# EAGLE design real-schematic (EAGLE 7.5.0)
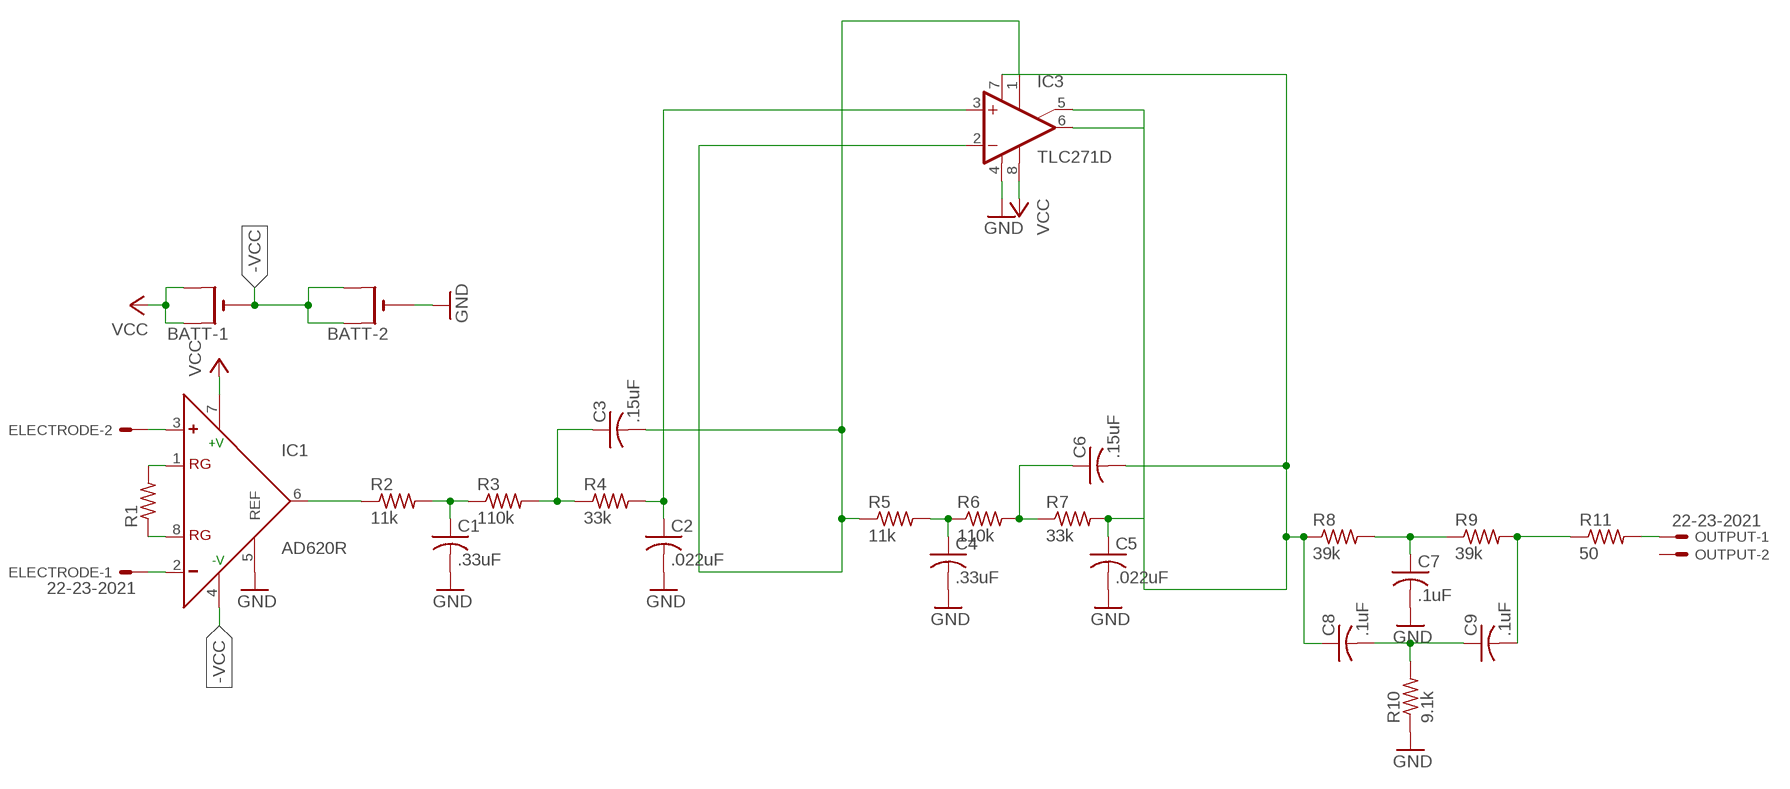
[diagram p0: schematic, sheet 1]

## Parts
BATT-1  CR1220SMT  [CR1220-SMD]
BATT-2  CR1220SMT  [CR1220-SMD]
C1  .33uF  C-USC0805  [C0805]
C2  .022uF  C-USC0805  [C0805]
C3  .15uF  C-USC0805  [C0805]
C4  .33uF  C-USC0805  [C0805]
C5  .022uF  C-USC0805  [C0805]
C6  .15uF  C-USC0805  [C0805]
C7  .1uF  C-USC0805  [C0805]
C8  .1uF  C-USC0805  [C0805]
C9  .1uF  C-USC0805  [C0805]
ELECTRODE  22-23-2021  [22-23-2021]
IC1  AD620R  [SO8]
IC3  TLC271D  [SO08]
OUTPUT  22-23-2021  [22-23-2021]
R1  R-US_R0805  [R0805]
R2  11k  R-US_R0805  [R0805]
R3  110k  R-US_R0805  [R0805]
R4  33k  R-US_R0805  [R0805]
R5  11k  R-US_R0805  [R0805]
R6  110k  R-US_R0805  [R0805]
R7  33k  R-US_R0805  [R0805]
R8  39k  R-US_R0805  [R0805]
R9  39k  R-US_R0805  [R0805]
R10  9.1k  R-US_R0805  [R0805]
R11  50  R-US_R0805  [R0805]

## Nets
-VCC: BATT-1.- BATT-2.+$1(+) BATT-2.+$2(+1) IC1.4(-V)
GND: BATT-2.- C1.2 C2.2 C4.2 C5.2 C7.2 IC1.5(REF) IC3.4(V-) R10.1
N$1: C4.1 R5.2 R6.1
N$2: IC1.6(OUT) R2.1
N$3: C1.1 R2.2 R3.1
N$4: C3.1 R3.2 R4.1
N$5: C2.1 IC3.3(+IN) R4.2
N$6: C3.2 IC3.1(ON1) IC3.2(-IN) R5.1
N$7: C6.1 R6.2 R7.1
N$8: C5.1 IC3.5(ON2) R7.2
N$9: C6.2 C8.1 IC3.6(OUT) IC3.7(V+) R8.1
N$10: C7.1 R8.2 R9.1
N$11: C9.2 R9.2 R11.1
N$12: C8.2 C9.1 R10.2
N$13: IC1.1(RG) R1.2
N$14: IC1.8(RG) R1.1
N$15: ELECTRODE.2 IC1.3(+)
N$16: ELECTRODE.1 IC1.2(-)
N$17: OUTPUT.1 R11.2
VCC: BATT-1.+$1(+) BATT-1.+$2(+1) IC1.7(+V) IC3.8(OPT)
Unconnected: OUTPUT.2

## Library data of the parts
BATT-1 BATT-2 = adafruit:CR1220: CR1216/CR1220/CR1225 12mm 3V lithium coin cell Great for battery packup. Both SMT and THM holders. Note the THM package has the ground pads on both sides of the PCB so that the masks are the same - this reduces the cost
C1-C9 = adafruit:C-US: CAPACITOR, American symbol
ELECTRODE OUTPUT = con-molex:22-23-2021: .100" (2.54mm) Center Header - 2 Pin; MF: MOLEX; MPN: 22-23-2021; OC_FARNELL: 1462926; OC_NEWARK: 25C3832
IC1 = analog-devices:AD620: Low Cost, Low Power, Instrumentation Amplifier Source: http://www.analog.com/UploadedFiles/Data_Sheets/37793330023930AD620_e.pdf; MPN: AD620AR; OC_FARNELL: 1464424; OC_NEWARK: 05F7109
IC3 = linear:TLC271: OP AMP
R1-R11 = adafruit:R-US_: RESISTOR, American symbol

## Board
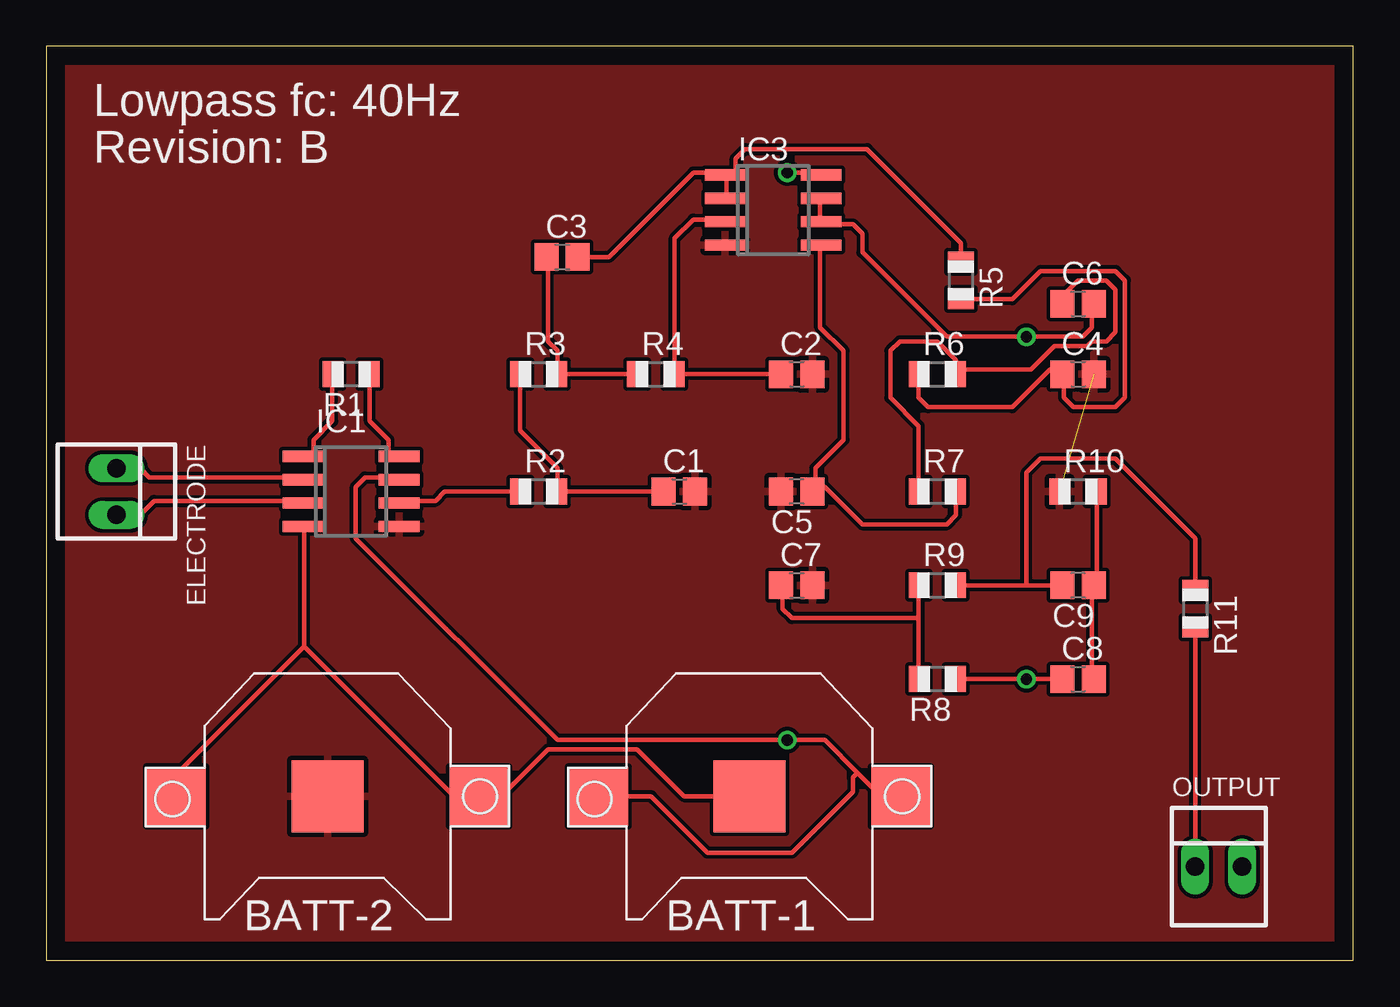
[diagram p1: board, top side]
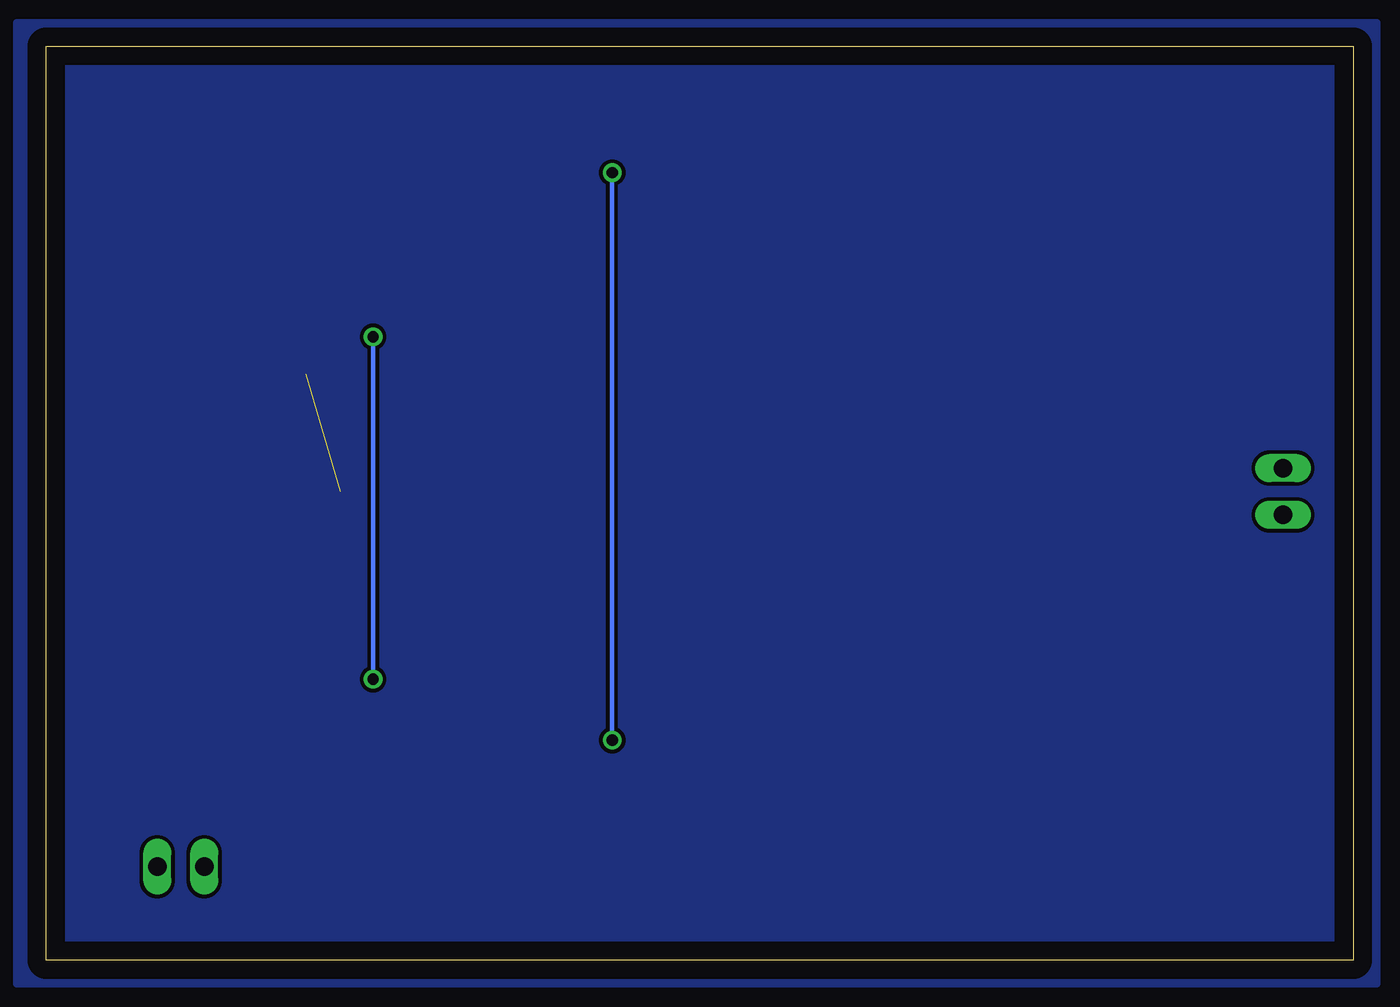
[diagram p2: board, bottom side, seen from below]

Size 70.79 x 49.52 mm. Coordinates in mm from the lower left corner, seen from the top.
Outline: 0,0 70.79,0 70.79,49.52 0,49.52 0,0
Copper layers (1*16): Top 0.035mm / dielectric 1.5mm / Bottom 0.035mm
Design rules "default": minimum track width 10mil, minimum drill 24mil, track to track 8mil, track to pad 8mil, pad to pad 8mil, via to via 8mil, smd to smd 8mil, copper to edge 40mil, drill to drill 8mil, minimum pad ring 10mil, minimum via ring 8mil, stop-mask expansion 4mil, vias tented up to drill 0mil, thermal gap 10mil

### Footprints (pad centres in the part's own frame; a part is rotated, then mirrored left to right if it is on the bottom)
CR1220-SMD = smd 3.2 x 3.2: +$1 -8.2,0; +$2 8.2,0 | smd 3.9 x 3.9: - 0,0
C0805 = smd 1.3 x 1.5: 1 -0.85,0; 2 0.85,0
22-23-2021 = drill 1 long: 1 -1.27,0; 2 1.27,0
SO8 = smd 0.6 x 2.2: 1 -1.905,-2.6; 2 -0.635,-2.6; 3 0.635,-2.6; 4 1.905,-2.6; 5 1.905,2.6; 6 0.635,2.6; 7 -0.635,2.6; 8 -1.905,2.6
SO08 = smd 0.6 x 2.2: 1 -1.905,-2.6; 2 -0.635,-2.6; 3 0.635,-2.6; 4 1.905,-2.6; 5 1.905,2.6; 6 0.635,2.6; 7 -0.635,2.6; 8 -1.905,2.6
R0805 = smd 1.1 x 1.4: 1 -1,0; 2 1,0

### Placement (x,y rotation side)
BATT-1  38.1,8.89 180 top
BATT-2  15.24,8.89 180 top
C1  34.29,25.4 0 top
C2  40.64,31.75 0 top
C3  27.94,38.1 0 top
C4  55.88,31.75 0 top
C5  40.64,25.4 180 top
C6  55.88,35.56 0 top
C7  40.64,20.32 0 top
C8  55.88,15.24 0 top
C9  55.88,20.32 180 top
ELECTRODE  3.81,25.4 270 top
IC1  16.51,25.4 270 top
IC3  39.37,40.64 270 top
OUTPUT  63.5,5.08 0 top
R1  16.51,31.75 180 top
R2  26.67,25.4 0 top
R3  26.67,31.75 0 top
R4  33.02,31.75 0 top
R5  49.53,36.83 270 top
R6  48.26,31.75 0 top
R7  48.26,25.4 0 top
R8  48.26,15.24 180 top
R9  48.26,20.32 0 top
R10  55.88,25.4 0 top
R11  62.23,19.05 270 top

### Tracks (layer width: path | path; a pad name or v marks a point on that pad's centre or on a via)
-VCC
  Top 0.254: 13.97,17.02 13.97,23.37 IC1.4 | 13.97,17.02 7.11,10.16 7.11,8.89 BATT-2.+$2 | 13.97,17.02 22.1,8.89 BATT-2.+$1 24.64,8.89 27.18,11.43 32,11.43 34.54,8.89 BATT-1.-
GND  (1 unrouted)
  pour Top: -1.27,50.8 -1.27,-1.27 74.93,-1.27 74.93,50.8
  pour Bottom: -1.27,50.8 -1.27,-1.27 72.39,-1.27 72.39,50.8
N$1
  Top 0.254: R6.1 47.24,31.75 47.24,30.48 47.75,29.97 52.32,29.97 54.36,32 54.61,32 54.86,31.75 C4.1 55.12,31.75 55.12,30.48 55.63,29.97 57.91,29.97 58.42,30.48 58.42,36.83 57.91,37.34 53.85,37.34 52.32,35.81 49.53,35.81 R5.2
N$2
  Top 0.254: R2.1 21.59,25.4 21.08,24.89 19.3,24.89 IC1.6
N$3
  Top 0.254: C1.1 27.69,25.4 | 27.69,25.4 27.69,26.67 25.65,28.7 25.65,31.75 R3.1 | 27.69,25.4 R2.2
N$4
  Top 0.254: R4.1 27.69,31.75 | 27.69,31.75 27.69,33.02 27.18,33.53 27.18,38.1 C3.1 | 27.69,31.75 R3.2
N$5
  Top 0.254: C2.1 34.04,31.75 | 34.04,31.75 34.04,39.12 35.05,40.13 36.58,40.13 IC3.3 | 34.04,31.75 R4.2
N$6
  Top 0.254: R5.1 49.53,38.86 44.45,43.94 37.85,43.94 37.34,43.43 37.34,42.67 37.08,42.42 36.83,42.42 | C3.2 30.48,38.1 35.05,42.67 36.58,42.67 IC3.1 36.83,42.42 | 36.83,42.42 36.83,41.4 IC3.2
N$7
  Top 0.254: 49.28,32 49.28,31.75 R6.2 49.28,32 | 49.28,32 49.28,32.51 48.26,33.53 46.23,33.53 45.72,33.02 45.72,30.48 47.24,28.96 47.24,25.4 R7.1 | 49.28,32 53.34,32 54.61,33.27 56.39,33.27 56.64,33.53 57.4,33.53 57.91,34.04 57.91,36.32 57.4,36.83 55.88,36.83 55.12,36.07 55.12,35.56 C6.1
N$8
  Top 0.254: 41.66,25.4 41.91,25.65 42.16,25.65 44.2,23.62 48.77,23.62 49.28,24.13 49.28,25.4 R7.2 | 41.66,25.4 41.66,26.67 43.18,28.19 43.18,33.02 41.91,34.29 41.91,38.61 IC3.5 | 41.66,25.4 C5.1
N$9  (via drill 0.61)
  Top 0.254: C8.1 v53.09,15.24 R8.1 | C6.2 56.64,35.56 56.64,34.29 56.13,33.78 v53.09,33.78 48.77,33.78 44.2,38.35 44.2,39.37 43.69,39.88 42.16,39.88 IC3.6 41.91,40.13 41.91,41.15 IC3.7
  Bottom 0.254: v53.09,33.78 v53.09,15.24
N$10
  Top 0.254: 47.24,18.54 47.24,20.32 R9.1 | 47.24,18.54 47.24,15.24 R8.2 | 47.24,18.54 40.39,18.54 39.88,19.05 39.88,20.32 C7.1
N$11
  Top 0.254: C9.2 53.09,20.32 | 53.09,20.32 R9.2 | R11.1 62.23,22.86 57.91,27.18 53.85,27.18 53.09,26.42 53.09,20.32
N$12
  Top 0.254: R10.2 56.9,25.4 56.9,20.32 C9.1 56.64,20.32 56.64,15.24 C8.2
N$13
  Top 0.254: R1.2 15.49,31.75 15.49,29.21 14.48,28.19 14.48,27.43 14.22,27.18 13.97,27.18 IC1.1
N$14
  Top 0.254: R1.1 17.53,31.75 17.53,29.21 18.54,28.19 18.54,27.43 18.8,27.18 19.05,27.18 IC1.8
N$15
  Top 0.254: ELECTRODE.2 5.08,24.13 5.84,24.89 13.72,24.89 IC1.3
N$16
  Top 0.254: ELECTRODE.1 5.08,26.67 5.59,26.16 13.72,26.16 IC1.2
N$17
  Top 0.254: OUTPUT.1 R11.2
VCC  (via drill 0.61)
  Top 0.254: 43.94,10.16 45.21,8.89 BATT-1.+$1 | 43.94,10.16 42.16,11.94 v40.13,11.94 27.69,11.94 16.76,22.86 16.76,25.65 17.27,26.16 19.05,26.16 IC1.7 | v40.13,42.67 41.91,42.67 IC3.8 | BATT-1.+$2 32.77,8.89 35.81,5.84 40.39,5.84 43.69,9.14 43.69,9.91 43.94,10.16
  Bottom 0.254: v40.13,11.94 v40.13,42.67

### Text on the board
tPlace: Lowpass fc: 40Hz | Revision: B